# EAGLE design minimum_sistem_sisi_pemrogram (EAGLE 4.11)
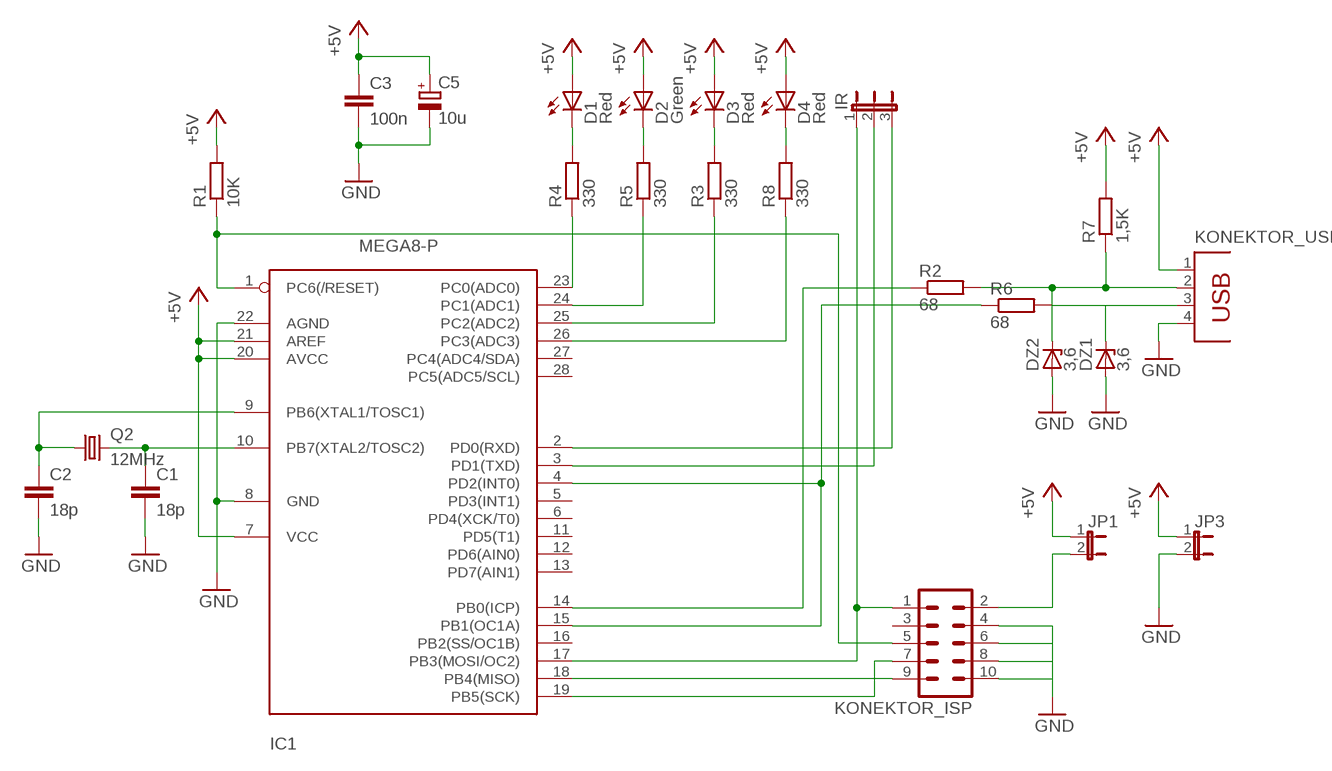
[diagram p0: schematic, sheet 1]

## Parts
C1  18p  C-EU025-024X044  [C025-024X044]
C2  18p  C-EU025-024X044  [C025-024X044]
C3  100n  C7.5/3  [C7.5B3]
C5  10u  CPOL-EUE2.5-5  [E2,5-5]
D1  Red  LED5MM  [LED5MM]
D2  Green  LED5MM  [LED5MM]
D3  Red  LED5MM  [LED5MM]
D4  Red  LED5MM  [LED5MM]
DZ1  3,6  ZENER-DIODEDO34-7  [DO34Z7]
DZ2  3,6  ZENER-DIODEDO34-7  [DO34Z7]
IC1  MEGA8-P  [DIL28-3]
IR  JP2E  [JP2]
JP1  JP1E  [JP1]
JP3  JP1E  [JP1]
KONEKTOR_ISP  ML10  [ML10]
KONEKTOR_USB  PN61729  [PN61729]
Q2  12MHz  CRYTALHC49S  [HC49/S]
R1  10K  R-EU_0207/10  [0207/10]
R2  68  R-EU_0207/10  [0207/10]
R3  330  R-EU_0207/10  [0207/10]
R4  330  R-EU_0207/10  [0207/10]
R5  330  R-EU_0207/10  [0207/10]
R6  68  R-EU_0207/10  [0207/10]
R7  1,5K  R-EU_0207/10  [0207/10]
R8  330  R-EU_0207/10  [0207/10]

## Nets
+5V: C3.1 C5.+ D1.A D2.A D3.A D4.A IC1.7(VCC) IC1.20(AVCC) IC1.21(AREF) JP1.1 JP3.1 KONEKTOR_USB.1 R1.2 R7.2
GND: C1.2 C2.2 C3.2 C5.- DZ1.A DZ2.A IC1.8(GND) IC1.22(AGND) JP3.2 KONEKTOR_ISP.4 KONEKTOR_ISP.6 KONEKTOR_ISP.8 KONEKTOR_ISP.10 KONEKTOR_USB.4
N$1: DZ2.C KONEKTOR_USB.2 R2.2 R7.1
N$2: DZ1.C KONEKTOR_USB.3 R6.2
N$3: C1.1 IC1.10(PB7(XTAL2/TOSC2)) Q2.2
N$4: C2.1 IC1.9(PB6(XTAL1/TOSC1)) Q2.1
N$5: JP1.2 KONEKTOR_ISP.2
N$7: IC1.3(PD1(TXD)) IR.2
N$8: IC1.2(PD0(RXD)) IR.3
N$9: IC1.17(PB3(MOSI/OC2)) IR.1 KONEKTOR_ISP.1
N$10: IC1.19(PB5(SCK)) KONEKTOR_ISP.7
N$11: IC1.18(PB4(MISO)) KONEKTOR_ISP.9
N$12: IC1.25(PC2(ADC2)) R3.1
N$13: IC1.1(PC6(/RESET)) KONEKTOR_ISP.5 R1.1
N$14: IC1.14(PB0(ICP)) R2.1
N$15: IC1.26(PC3(ADC3)) R8.1
N$16: IC1.23(PC0(ADC0)) R4.1
N$17: IC1.24(PC1(ADC1)) R5.1
N$18: IC1.4(PD2(INT0)) IC1.15(PB1(OC1A)) R6.1
N$19: D1.K(C) R4.2
N$20: D2.K(C) R5.2
N$23: D3.K(C) R3.2
N$24: D4.K(C) R8.2
Unconnected: IC1.5(PD3(INT1)) IC1.6(PD4(XCK/T0)) IC1.11(PD5(T1)) IC1.12(PD6(AIN0)) IC1.13(PD7(AIN1)) IC1.16(PB2(SS/OC1B)) IC1.27(PC4(ADC4/SDA)) IC1.28(PC5(ADC5/SCL)) KONEKTOR_ISP.3

## Library data of the parts
C1 C2 = rcl:C-EU: CAPACITOR, European symbol
C3 = capacitor-wima:C: CAPACITOR naming: grid - package width
C5 = rcl:CPOL-EU: POLARIZED CAPACITOR, European symbol
D1-D4 = led:LED: LED OSRAM: - CHIPLED LG R971, LG N971, LY N971, LG Q971, LY Q971, LO R971, LY R971 LH N974, LH R974 LS Q976, LO Q976, LY Q976 LO Q996 - Hyper CHIPLED LW Q18S LB Q993, LB Q99A, LB R99A - SideLED LS A670, LO A670, LY A670, LG A670, LP A670 LB A673, LV A673, LT A673, LW A673 LH A674 LY A675 LS A676, LA A676, LO A676, LY A676, LW A676 LS A679, LY A679, LG A679 - Hyper Micro SIDELED® LS Y876, LA Y876, LO Y876, LY Y876 LT Y87S - SmartLED LW L88C, LW L88S LB L89C, LB L89S, LG L890 LS L89K, LO L89K, LY L89K LS L896, LA L896, LO L896, LY L896 - TOPLED LS T670, LO T670, LY T670, LG T670, LP T670 LSG T670, LSP T670, LSY T670, LOP T670, LYG T670 LG T671, LOG T671, LSG T671 LB T673, LV T673, LT T673, LW T673 LH T674 LS T676, LA T676, LO T676, LY T676, LB T676, LH T676, LSB T676, LW T676 LB T67C, LV T67C, LT T67C, LS T67K, LO T67K, LY T67K, LW E67C LS E67B, LA E67B, LO E67B, LY E67B, LB E67C, LV E67C, LT E67C LW T67C LS T679, LY T679, LG T679 LS T770, LO T770, LY T770, LG T770, LP T770 LB T773, LV T773, LT T773, LW T773 LH T774 LS E675, LA E675, LY E675, LS T675 LS T776, LA T776, LO T776, LY T776, LB T776 LHGB T686 LT T68C, LB T68C - Hyper Mini TOPLED® LB M676 - Mini TOPLED Santana® LG M470 LS M47K, LO M47K, LY M47K Source: http://www.osram.convergy.de/
DZ1 DZ2 = diode:ZENER-DIODE: Z-Diode
IC1 = atmel:MEGA8-P: MICROCONTROLLER 8 Kbytes FLASH 1 kbytes SRAM 512 bytes EEPROM USART 4-channel 10 bit ADC 2-channel 8 bit ADC Source: avr.lbr
IR = jumper:JP2E: JUMPER
JP1 JP3 = jumper:JP1E: JUMPER
KONEKTOR_ISP = con-harting-ml:ML10: HARTING
KONEKTOR_USB = con-berg:PN61729: BERG USB connector
Q2 = crystal:CRYTAL: CRYSTAL
R1-R8 = rcl:R-EU_: RESISTOR, European symbol

## Board
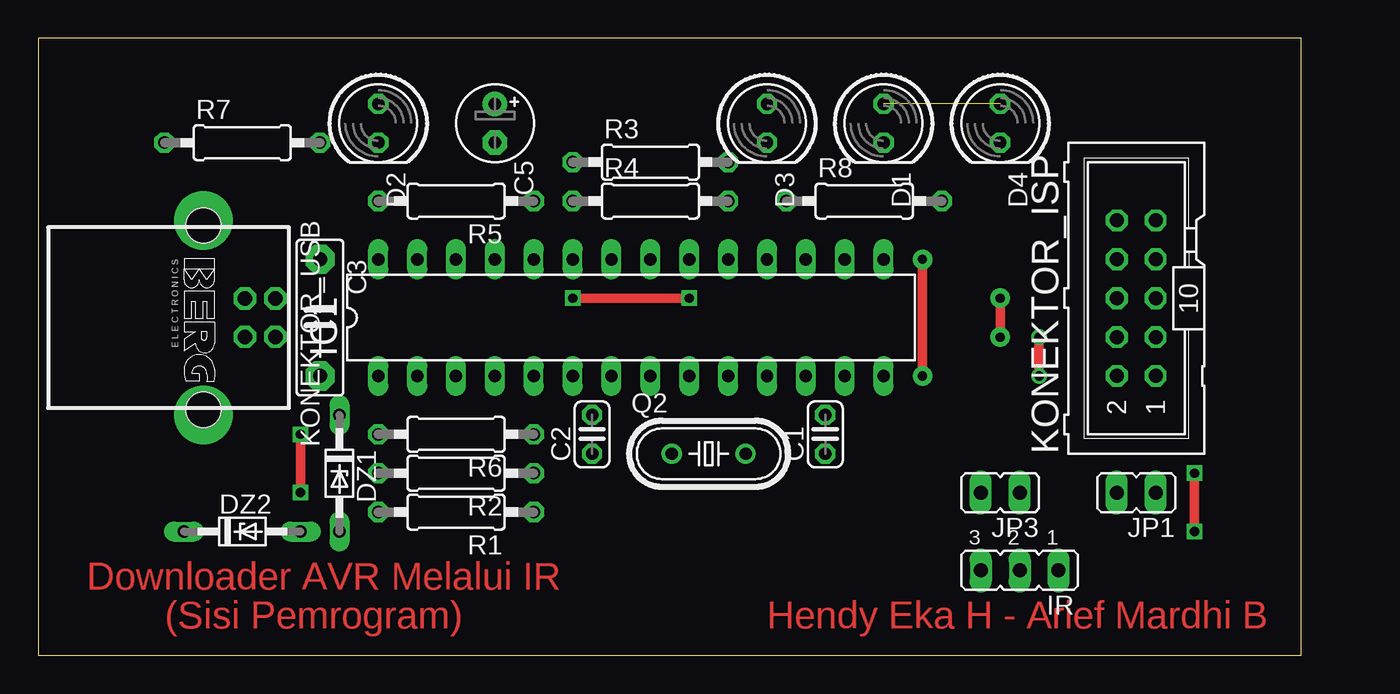
[diagram p1: board, top side]
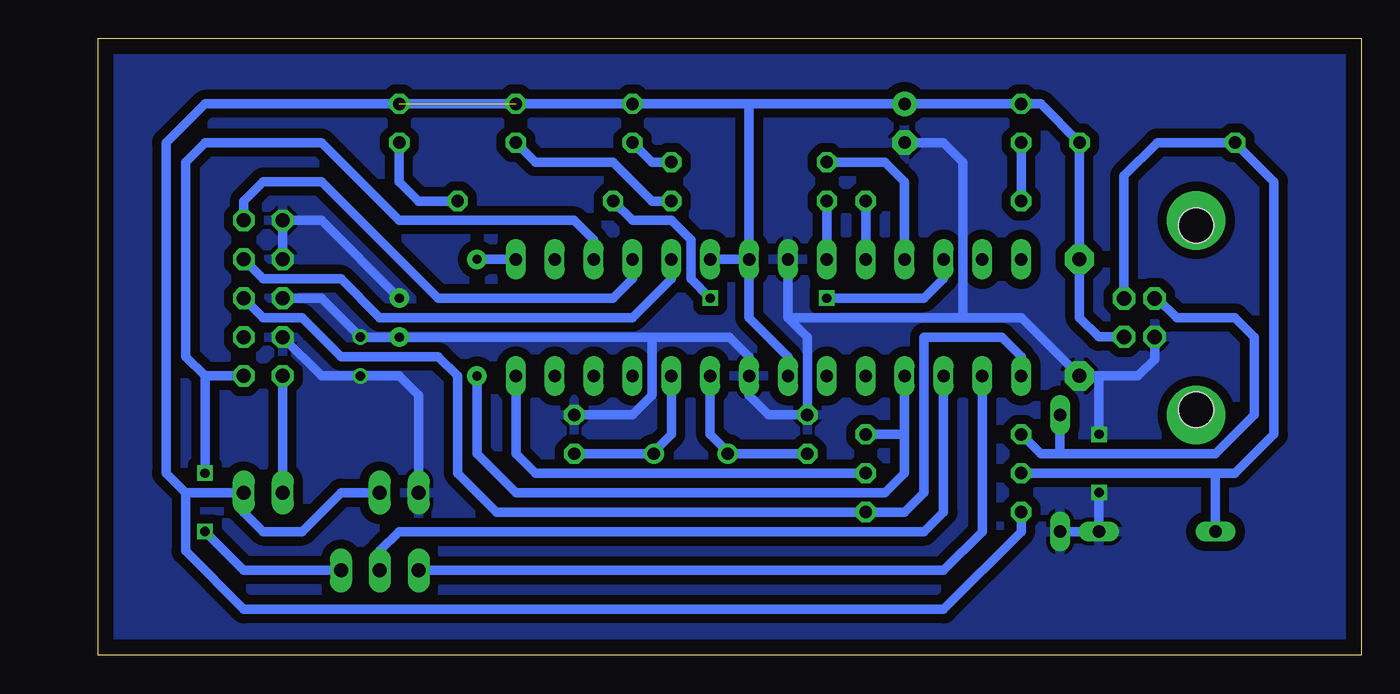
[diagram p2: board, bottom side, seen from below]

Size 82.54 x 40.31 mm. Coordinates in mm from the lower left corner, seen from the top.
Outline: 82.54,0 82.54,40.31 0,40.31 0,0 82.54,0
Copper layers (1*16): Top 0.035mm / dielectric 1.5mm / Bottom 0.035mm
Design rules "default": minimum track width 10mil, minimum drill 24mil, track to track 8mil, track to pad 8mil, pad to pad 8mil, via to via 8mil, smd to smd 8mil, copper to edge 40mil, drill to drill 8mil, minimum pad ring 10mil, minimum via ring 8mil, stop-mask expansion 4mil, vias tented up to drill 0mil, thermal gap 10mil

### Footprints (pad centres in the part's own frame; a part is rotated, then mirrored left to right if it is on the bottom)
C025-024X044 = drill 0.813 octagon: 1 -1.27,0; 2 1.27,0
C7.5B3 = drill 0.914 pad 1.905 octagon: 1 -3.81,0; 2 3.81,0
E2,5-5 = drill 0.813 pad 1.6 round: + -1.27,0 | drill 0.813 pad 1.6 octagon: - 1.27,0
LED5MM = drill 0.813 octagon: A -1.27,0; K 1.27,0
DO34Z7 = drill 0.813 long: A 3.81,0; C -3.81,0
DIL28-3 = drill 0.813 long: 1 -16.51,-3.81; 2 -13.97,-3.81; 3 -11.43,-3.81; 4 -8.89,-3.81; 5 -6.35,-3.81; 6 -3.81,-3.81; 7 -1.27,-3.81; 8 1.27,-3.81; 9 3.81,-3.81; 10 6.35,-3.81; 11 8.89,-3.81; 12 11.43,-3.81; 13 13.97,-3.81; 14 16.51,-3.81; 15 16.51,3.81; 16 13.97,3.81; 17 11.43,3.81; 18 8.89,3.81; 19 6.35,3.81; 20 3.81,3.81; 21 1.27,3.81; 22 -1.27,3.81; 23 -3.81,3.81; 24 -6.35,3.81; 25 -8.89,3.81; 26 -11.43,3.81; 27 -13.97,3.81; 28 -16.51,3.81
JP2 = drill 0.914 long: 1 -2.54,0; 2 0,0; 3 2.54,0
JP1 = drill 0.914 long: 1 0,-1.27; 2 0,1.27
ML10 = drill 0.914 octagon: 1 -5.08,-1.27; 2 -5.08,1.27; 3 -2.54,-1.27; 4 -2.54,1.27; 5 0,-1.27; 6 0,1.27; 7 2.54,-1.27; 8 2.54,1.27; 9 5.08,-1.27; 10 5.08,1.27
PN61729 = drill 0.95 octagon: 1 1.25,4.71; 2 -1.25,4.71; 3 -1.25,2.71; 4 1.25,2.71 | hole 2.3: -6.02,0; 6.02,0
HC49/S = drill 0.813 round: 1 -2.413,0; 2 2.413,0
0207/10 = drill 0.813 octagon: 1 -5.08,0; 2 5.08,0

### Placement (x,y rotation side)
C1  51.43,14.44 90 top
C2  36.19,14.44 90 top
C3  18.41,22.06 270 top
C5  29.84,34.76 270 top
D1  55.24,34.76 270 top
D2  22.22,34.76 270 top
D3  47.62,34.76 270 top
D4  62.86,34.76 270 top
DZ1  19.68,11.9 270 top
DZ2  13.33,8.09 0 top
IC1  38.73,22.06 0 top
IR  64.13,5.55 180 top
JP1  71.75,10.63 90 top
JP3  62.86,10.63 90 top
KONEKTOR_ISP  71.75,23.33 90 top
KONEKTOR_USB  10.79,22.06 270 top
Q2  43.81,13.17 0 top
R1  27.3,9.36 180 top
R2  27.3,11.9 180 top
R3  40,32.22 0 top
R4  40,29.68 0 top
R5  27.3,29.68 180 top
R6  27.3,14.44 180 top
R7  13.33,33.49 0 top
R8  53.97,29.68 0 top

### Tracks (layer width: path | path; a pad name or v marks a point on that pad's centre or on a via)
+5V  (1 unrouted)
  Bottom 0.61: IC1.21 IC1.20 | IC1.7 37.46,19.52 40,22.06 IC1.21 | KONEKTOR_USB.1 17.16,20.81 18.41,22.06 C3.1 R7.2 20.95,36.03 D2.A C5.+ 40,36.03 | IC1.21 IC1.20 | IC1.21 IC1.20 | 40,36.03 IC1.21 | 76.83,10.63 78.1,11.9 78.1,33.49 75.56,36.03 D1.A D3.A 40,36.03 | 76.83,10.63 JP1.1 73.02,9.36 71.75,8.09 69.21,8.09 66.67,10.63 JP3.1 | R1.2 22.22,8.09 27.3,3.01 73.02,3.01 76.83,6.82 76.83,10.63
GND  (via drill 0.6 pad 1.27, 0.61)
  Top 0.61: v17.14,10.63 v17.14,14.44 | v62.86,20.79 v62.86,23.33 v62.86,20.79 | v65.4,20.79 v65.4,18.25 v65.4,20.79
  Bottom 0.61: 40,19.52 IC1.8 40,16.98 | 46.35,20.79 41.27,20.79 40,19.52 | 46.35,20.79 46.35,16.98 47.62,15.71 C1.2 | 40,16.98 40,19.52 | 40,16.98 38.73,15.71 C2.2 36.19,20.79 37.46,22.06 | 37.46,22.06 IC1.22 | 26.03,22.06 37.46,22.06 | 26.03,22.06 22.22,22.06 C3.2 17.14,18.25 | KONEKTOR_USB.4 13.5,19.35 14.6,18.25 17.14,18.25 | C5.- 27.3,33.49 26.03,32.22 26.03,22.06 | DZ1.A DZ2.A v17.14,10.63 | v17.14,14.44 17.14,18.25 | 46.35,20.79 v62.86,20.79 | KONEKTOR_ISP.6 67.94,23.33 v65.4,20.79 | v62.86,20.79 v65.4,20.79 | JP3.2 61.59,16.98 62.86,18.25 v65.4,18.25 67.94,18.25 KONEKTOR_ISP.4 | KONEKTOR_ISP.8 KONEKTOR_ISP.10 67.94,28.41 v62.86,23.33 | v62.86,20.79 v65.4,20.79
  pour Bottom (isolate 0.61): 0.63,39.84 81.91,39.84 81.91,0.47 0.63,0.47
N$1
  Bottom 0.61: KONEKTOR_USB.2 15.5,31.32 13.33,33.49 R7.1 5.71,30.95 5.71,14.44 8.25,11.9 9.52,11.9 | 9.52,11.9 R2.2 | DZ2.C 9.52,11.9
N$2
  Bottom 0.61: KONEKTOR_USB.3 13.31,23.31 12.06,22.06 8.25,22.06 6.98,20.79 6.98,15.71 9.52,13.17 19.68,13.17 | 19.68,13.17 20.95,13.17 R6.2 | 19.68,13.17 DZ1.C
N$3
  Bottom 0.61: IC1.10 45.08,14.44 46.35,13.17 Q2.2 C1.1
N$4
  Bottom 0.61: IC1.9 42.54,14.44 41.27,13.17 | C2.1 41.27,13.17 | 41.27,13.17 Q2.1
N$5
  Bottom 0.61: JP1.2 KONEKTOR_ISP.2
N$7
  Bottom 0.61: IR.2 64.13,6.82 62.86,8.09 28.57,8.09 27.3,9.36 IC1.3
N$8
  Bottom 0.61: IR.3 27.3,5.55 24.76,8.09 IC1.2
N$9  (via drill 0.61)
  Top 0.61: v75.56,11.9 v75.56,8.09
  Bottom 0.61: IC1.17 50.16,27.14 51.43,28.41 62.86,28.41 67.94,33.49 75.56,33.49 76.83,32.22 76.83,19.52 75.56,18.25 | 75.56,18.25 KONEKTOR_ISP.1 | 75.56,18.25 v75.56,11.9 | IR.1 73.02,5.55 v75.56,8.09
N$10
  Bottom 0.61: IC1.19 45.08,24.6 47.62,22.06 64.13,22.06 66.67,24.6 71.75,24.6 KONEKTOR_ISP.7
N$11
  Bottom 0.61: KONEKTOR_ISP.9 73.02,29.68 71.75,30.95 67.94,30.95 60.32,23.33 48.89,23.33 47.62,24.6 IC1.18
N$12
  Bottom 0.61: IC1.25 29.84,30.95 31.11,32.22 R3.1
N$13
  Bottom 0.61: KONEKTOR_ISP.5 71.75,22.06 69.21,22.06 66.67,19.52 60.32,19.52 59.05,18.25 59.05,11.9 56.51,9.36 R1.1 29.84,9.36 28.57,10.63 28.57,20.79 23.49,20.79 22.22,19.52 IC1.1
N$14
  Bottom 0.61: IC1.14 55.24,13.17 53.97,11.9 R2.1
N$15  (via drill 0.61)
  Top 0.61: v42.54,23.33 v34.92,23.33
  Bottom 0.61: R8.1 47.62,28.41 45.08,28.41 43.81,27.14 43.81,24.6 v42.54,23.33 | v34.92,23.33 28.57,23.33 27.3,24.6 IC1.26
N$16
  Bottom 0.61: IC1.23 R4.1
N$17
  Bottom 0.61: IC1.24 R5.1
N$18  (via drill 0.6 pad 1.27)
  Top 0.61: v57.78,18.25 v57.78,25.87
  Bottom 0.61: v57.78,25.87 IC1.15 | 29.84,14.44 IC1.4 | 29.84,14.44 R6.1 | 29.84,14.44 29.84,11.9 31.11,10.63 55.24,10.63 57.78,13.17 v57.78,18.25
N$19
  Bottom 0.61: R4.2 46.35,29.68 48.89,32.22 53.97,32.22 D1.K
N$20
  Bottom 0.61: R5.2 D2.K
N$21  (via drill 1.5 pad 3.81)
  other vias: 10.79,28.41
N$22  (via drill 1.5 pad 3.81)
  other vias: 10.79,15.71
N$23
  Bottom 0.61: R3.2 46.35,32.22 D3.K
N$24
  Bottom 0.61: D4.K 62.86,30.95 61.59,29.68 R8.2

### Text on the board
Top: Downloader AVR Melalui IR | (Sisi Pemrogram) | Hendy Eka H - Arief Mardhi B